# Altium schematic sheet CW308T_S6LX9_FPGAMisc.SchDoc: FPGA Power Meas, Decoupling, JTAG
size Letter; Organization: NewAE Technology Inc.; Address1: 1083 Queen St., Suite 196; Address2: Halifax; Address3: NS; Address4: Canada B3H 0B2; SheetNumber: 2; SheetTotal: 3; SheetApproved: Yes
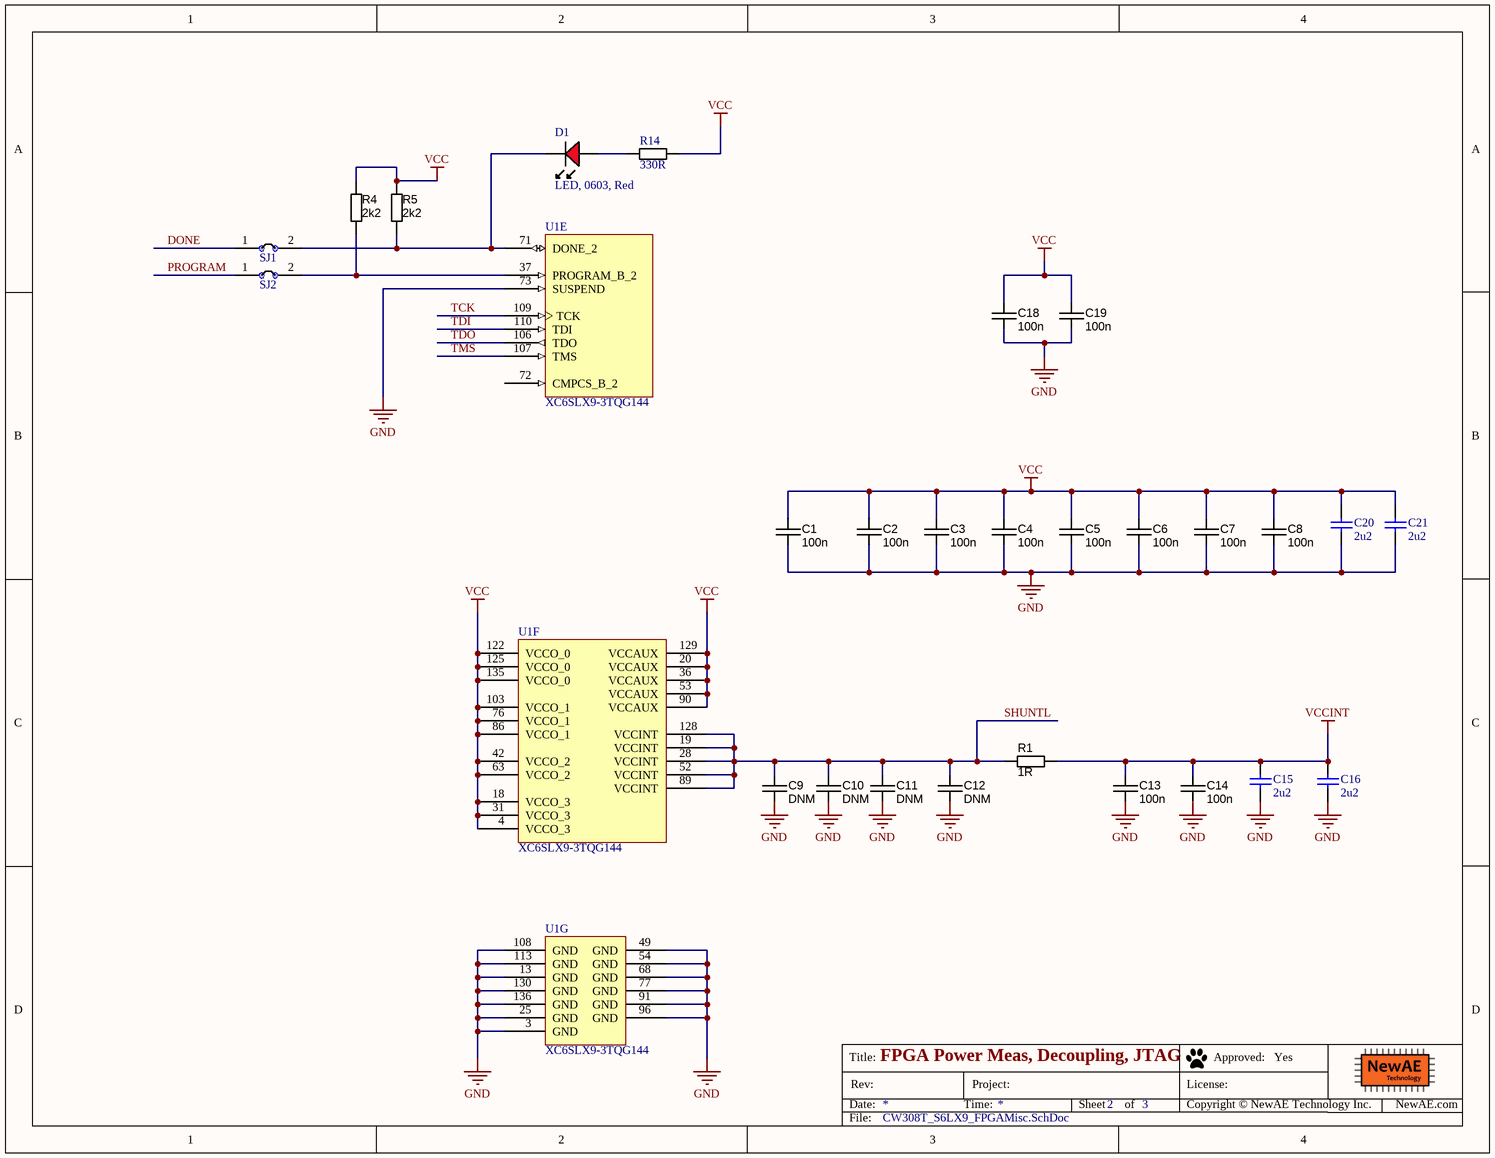
[diagram p0: CW308T_S6LX9_FPGAMisc.SchDoc]

## Parts
(Parts that share a designator on the sheet are numbered #1, #2 ... from top to bottom, then left to right.)
C1  value 100n  [CAPC1608X90N]  (hidden comment: approved sub OK)
C2  value 100n  [CAPC1608X90N]  (hidden comment: approved sub OK)
C3  value 100n  [CAPC1608X90N]  (hidden comment: approved sub OK)
C4  value 100n  [CAPC1608X90N]  (hidden comment: approved sub OK)
C5  value 100n  [CAPC1608X90N]  (hidden comment: approved sub OK)
C6  value 100n  [CAPC1608X90N]  (hidden comment: approved sub OK)
C7  value 100n  [CAPC1608X90N]  (hidden comment: approved sub OK)
C8  value 100n  [CAPC1608X90N]  (hidden comment: approved sub OK)
C9  value DNM  [CAPC1608X90N]  (hidden comment: approved sub OK)
C10  value DNM  [CAPC1608X90N]  (hidden comment: approved sub OK)
C11  value DNM  [CAPC1608X90N]  (hidden comment: approved sub OK)
C12  value DNM  [CAPC1608X90N]  (hidden comment: approved sub OK)
C13  value 100n  [CAPC1608X90N]  (hidden comment: approved sub OK)
C14  value 100n  [CAPC1608X90N]  (hidden comment: approved sub OK)
C15  2u2  [CAPC0603_M]
C16  2u2  [CAPC0603_M]
C18  value 100n  [CAPC1608X90N]  (hidden comment: approved sub OK)
C19  value 100n  [CAPC1608X90N]  (hidden comment: approved sub OK)
C20  2u2  [CAPC0603_M]
C21  2u2  [CAPC0603_M]
D1  LED, 0603, Red  [LED-0603-RED]
R1  value 1R  [RESC1608X55N]  (hidden comment: Thick Film)
R4  value 2k2  [RESC1608X55N]  (hidden comment: Thick Film)
R5  value 2k2  [RESC1608X55N]  (hidden comment: Thick Film)
R14  330R  [RESC1608X55N]
SJ1  NC  [SJ_2S_NC]  (value not drawn)  (no BOM)
SJ2  NC  [SJ_2S_NC]  (value not drawn)  (no BOM)
U1#1  XC6SLX9-3TQG144  [TQG144_L]  (parts E,F of 7)
U1#2  XC6SLX9-3TQG144  [TQG144_L]  (part G of 7)

## Nets
GND: C1.2 C2.2 C3.2 C4.2 C5.2 C6.2 C7.2 C8.2 C9.2 C10.2 C11.2 C12.2 C13.2 C14.2 C15.2 C16.2 C18.2 C19.2 C20.2 C21.2 U1#1.73(SUSPEND) U1#2.3(GND) U1#2.13(GND) U1#2.25(GND) U1#2.49(GND) U1#2.54(GND) U1#2.68(GND) U1#2.77(GND) U1#2.91(GND) U1#2.96(GND) U1#2.108(GND) U1#2.113(GND) U1#2.130(GND) U1#2.136(GND)
VCC: C1.1 C2.1 C3.1 C4.1 C5.1 C6.1 C7.1 C8.1 C18.1 C19.1 C20.1 C21.1 R4.1 R5.1 R14.2 U1#1.4(VCCO_3) U1#1.18(VCCO_3) U1#1.20(VCCAUX) U1#1.31(VCCO_3) U1#1.36(VCCAUX) U1#1.42(VCCO_2) U1#1.53(VCCAUX) U1#1.63(VCCO_2) U1#1.76(VCCO_1) U1#1.86(VCCO_1) U1#1.90(VCCAUX) U1#1.103(VCCO_1) U1#1.122(VCCO_0) U1#1.125(VCCO_0) U1#1.129(VCCAUX) U1#1.135(VCCO_0)
VCCINT: C13.1 C14.1 C15.1 C16.1 R1.2
DONE: SJ1.1
PROGRAM: SJ2.1
SHUNTL: C9.1 C10.1 C11.1 C12.1 R1.1 U1#1.19(VCCINT) U1#1.28(VCCINT) U1#1.52(VCCINT) U1#1.89(VCCINT) U1#1.128(VCCINT)
TCK: U1#1.109(TCK)
TDI: U1#1.110(TDI)
TDO: U1#1.106(TDO)
TMS: U1#1.107(TMS)
NetD1_A: D1.A R14.1
NetD1_K: D1.K R5.2 SJ1.2 U1#1.71(DONE_2)
NetR4_2: R4.2 SJ2.2 U1#1.37(PROGRAM_B_2)

Not connected (* = marked no-connect by the designer): U1#1 72(CMPCS_B_2)

## Notes on the sheet
- Title:
- Date:
- Rev:
- Time:
- Project:
- Sheet
- of
- License:
- Copyright © NewAE Technology Inc.
- Approved:
- NewAE.com
- File:

## Library data of the parts
C1-C14 C18 C19 = CAPC_100n_0603_X7R_50V_10%: Capacitor SMD Cer 100nF 10% 50V X7R 0603; Manufacturer 1: AVX Corporation; Manufacturer Part Number 1: 06035C104KAT2A; Ratings: 50V; X7R; Material: ceramic; SCDType: spec; Manufacturer 2: TDK Corporation; Manufacturer Part Number 2: C1608X7R1H104K; Package / Case: 0603 (1608 Metric); Tolerance: ±10%; Supplier 1: Digi-Key; Supplier Part Number 1: 478-5052-1-ND; ComponentLink1URL: http://www.avx.com/docs/Catalogs/cx7r.pdf; ComponentLink1Description: http://www.avx.com/docs/Catalogs/cx7r.pdf; Supplier 2: Digi-Key; Supplier Part Number 2: 445-1314-1-ND; ComponentLink2URL: http://product.tdk.com/capacitor/mlcc/en/documents/mlcc_commercial_general_en.pdf; ComponentLink2Description: http://product.tdk.com/capacitor/mlcc/en/documents/mlcc_commercial_general_en.pdf
C15 C16 C20 C21 = CCHIP-2u2-0603: 2u2, 0603; Component Group: Capacitor; Case-EIA: 0603; Case-Metric: 1608; Part Number: CCHIP-2u2-0603; Footprint: 0603; Pin Count: 2; Value: 2u2; Mounting Technology: SMT; Component Kind: Standard; Component Type: Standard
D1 = LEDCHIP_0603_RED: Chip LED, Red; Component Group: Optical; Part Number: LEDCHIP_0603_RED; Pin Count: 2; Mounting Technology: SMT; Component Kind: Standard; Component Type: Standard
R1 = RES_3R3_0603_5%: Resistor SMD chip 1 Ohm 0.1W 5% 0603; Manufacturer 1: Yageo; Manufacturer Part Number 1: RC0603JR-073R3L; Ratings: 1/10 W; SCDType: spec; Package / Case: 0603 (1608 metric); Tolerance: ±5%; ComponentLink1URL: http://www.yageo.com/documents/recent/PYu-RC0603_51_RoHS_L_4.pdf; ComponentLink1Description: http://www.yageo.com/documents/recent/PYu-RC0603_51_RoHS_L_4.pdf; Supplier 1: Digi-Key; Supplier Part Number 1: 311-3.3GRCT-ND
R4 R5 = RES_1K_0603_5%: Resistor SMD chip 1k Ohm 0.1W 5% 0603; Manufacturer 1: Yageo; Manufacturer Part Number 1: RC0603JR-071KL; Ratings: 1/10 W; SCDType: spec; Package / Case: 0603 (1608 metric); Tolerance: ±5%; Material: Thick Film; Supplier 1: Digi-Key; Supplier Part Number 1: 311-1.0KGRCT-ND; Supplier 2: Digi-Key; Supplier Part Number 2: 541-1.0KGCT-ND; Manufacturer 2: Vishay Dale; Manufacturer Part Number 2: CRCW06031K00JNEA; ComponentLink2URL: http://www.vishay.com/doc?20008; ComponentLink2Description: http://www.vishay.com/doc?20008; ComponentLink1URL: http://www.yageo.com/documents/recent/PYu-RC0603_51_RoHS_L_4.pdf; ComponentLink1Description: http://www.yageo.com/documents/recent/PYu-RC0603_51_RoHS_L_4.pdf
R14 = RCHIP-330R-0603: 330R res, 0603, 1%, 1/10W; Manufacture 1: Yageo; Manufacture Part Number 1: RC0603FR-07330RL; Component Group: Resistor; Case-EIA: 0603; Case-Metric: 1608; Rated Power: 0.1W; Rated Voltage: 75VDC; Part Number: RCHIP-330R-0603; Footprint: 0603; Pin Count: 2; Supplier 1: Digi-Key; Supplier Part Number 1: 311-330HRCT-ND; Value: 330R; Tolerance: 1%; Mounting Technology: SMT; Temperature Range: -55C to 155C; Component Kind: Standard; Component Type: Standard
SJ1 SJ2 = SJ_2S: Solder Jumper, NC
U1#1 U1#2 = CMP-0068-00084-1: Spartan-6 LX 1.0V FPGA, 102 User I/Os, 144-Pin TQFP (0.5mm Pitch), Low Power Version, Commercial Grade, Pb-Free; PackageDescription: 144-Pin Thin Quad Flat Pack (TQG144) - Pb-Free; DatasheetVersion: ver1.6, Nov-2010; PackageReference: TQG144; PackageVersion: ver1.2, Jun-2004; Code_JEDEC: MS-026-BFB; PartId: 1